# Altium schematic sheet power.SchDoc
size A; SheetNumber: 1; SheetTotal: 14
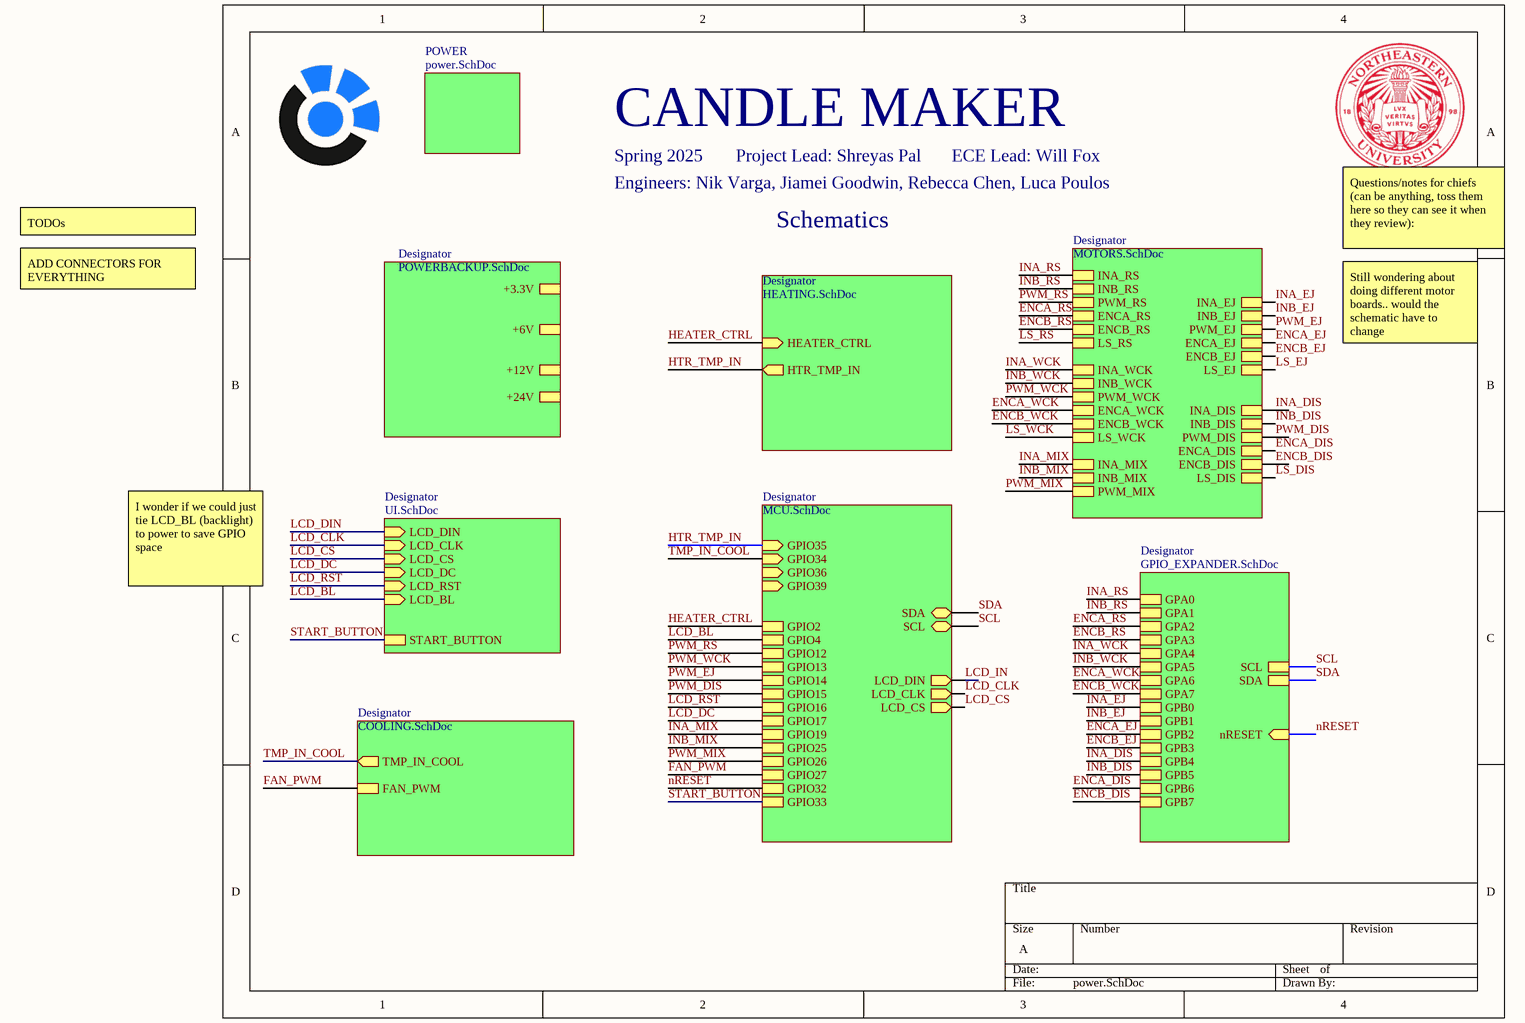
[diagram p0: power.SchDoc]

## Sub-sheets
Designator = HEATING.SchDoc: HEATER_CTRL (in), HTR_TMP_IN (out)
Designator = MCU.SchDoc: GPIO35 (in), SDA (bidir), SCL (bidir), LCD_DIN (out), LCD_CLK (out), LCD_CS (out), GPIO2, GPIO4, GPIO12, GPIO13, GPIO14, GPIO15, GPIO16, GPIO17, GPIO19, GPIO25, GPIO26, GPIO27, GPIO32, GPIO33, GPIO34 (in), GPIO36 (in), GPIO39 (in)
Designator = MOTORS.SchDoc: INA_RS, INB_RS, PWM_RS, ENCA_RS, ENCB_RS, LS_RS, INA_WCK, INB_WCK, PWM_WCK, ENCA_WCK, ENCB_WCK, LS_WCK, INA_MIX, INB_MIX, PWM_MIX, INA_EJ, INB_EJ, PWM_EJ, ENCA_EJ, ENCB_EJ, LS_EJ, INA_DIS, INB_DIS, PWM_DIS, ENCA_DIS, ENCB_DIS, LS_DIS
Designator = COOLING.SchDoc: TMP_IN_COOL (out), FAN_PWM
Designator = POWERBACKUP.SchDoc: +6V, +12V, +24V, +3.3V
Designator = UI.SchDoc: LCD_DIN (in), LCD_CLK (in), LCD_CS (in), LCD_DC (in), LCD_RST (in), LCD_BL (in), START_BUTTON
Designator = GPIO_EXPANDER.SchDoc: GPA0, GPA1, GPA2, GPA3, GPA4, GPA5, GPA6, GPA7, GPB0, GPB1, GPB2, GPB3, GPB4, GPB5, GPB6, GPB7, SCL, SDA, nRESET (in)
POWER = power.SchDoc: no entries

## Nets
ENCA_DIS: sheet Designator/ENCA_DIS, sheet Designator/GPB6
ENCA_EJ: sheet Designator/ENCA_EJ, sheet Designator/GPB2
ENCA_RS: sheet Designator/ENCA_RS, sheet Designator/GPA2
ENCA_WCK: sheet Designator/ENCA_WCK, sheet Designator/GPA6
ENCB_DIS: sheet Designator/ENCB_DIS, sheet Designator/GPB7
ENCB_EJ: sheet Designator/ENCB_EJ, sheet Designator/GPB3
ENCB_RS: sheet Designator/ENCB_RS, sheet Designator/GPA3
ENCB_WCK: sheet Designator/ENCB_WCK, sheet Designator/GPA7
FAN_PWM: sheet Designator/GPIO27, sheet Designator/FAN_PWM
HEATER_CTRL: sheet Designator/HEATER_CTRL, sheet Designator/GPIO2
HTR_TMP_IN: sheet Designator/HTR_TMP_IN, sheet Designator/GPIO35
INA_DIS: sheet Designator/INA_DIS, sheet Designator/GPB4
INA_EJ: sheet Designator/INA_EJ, sheet Designator/GPB0
INA_MIX: sheet Designator/GPIO19, sheet Designator/INA_MIX
INA_RS: sheet Designator/INA_RS, sheet Designator/GPA0
INA_WCK: sheet Designator/INA_WCK, sheet Designator/GPA4
INB_DIS: sheet Designator/INB_DIS, sheet Designator/GPB5
INB_EJ: sheet Designator/INB_EJ, sheet Designator/GPB1
INB_MIX: sheet Designator/GPIO25, sheet Designator/INB_MIX
INB_RS: sheet Designator/INB_RS, sheet Designator/GPA1
INB_WCK: sheet Designator/INB_WCK, sheet Designator/GPA5
LCD_BL: sheet Designator/GPIO4, sheet Designator/LCD_BL
LCD_CLK: sheet Designator/LCD_CLK, sheet Designator/LCD_CLK
LCD_CS: sheet Designator/LCD_CS, sheet Designator/LCD_CS
LCD_DC: sheet Designator/GPIO17, sheet Designator/LCD_DC
LCD_DIN: sheet Designator/LCD_DIN
LCD_IN: sheet Designator/LCD_DIN
LCD_RST: sheet Designator/GPIO16, sheet Designator/LCD_RST
LS_DIS: sheet Designator/LS_DIS
LS_EJ: sheet Designator/LS_EJ
LS_RS: sheet Designator/LS_RS
LS_WCK: sheet Designator/LS_WCK
nRESET: sheet Designator/GPIO32, sheet Designator/nRESET
PWM_DIS: sheet Designator/GPIO15, sheet Designator/PWM_DIS
PWM_EJ: sheet Designator/GPIO14, sheet Designator/PWM_EJ
PWM_MIX: sheet Designator/GPIO26, sheet Designator/PWM_MIX
PWM_RS: sheet Designator/GPIO12, sheet Designator/PWM_RS
PWM_WCK: sheet Designator/GPIO13, sheet Designator/PWM_WCK
SCL: sheet Designator/SCL, sheet Designator/SCL
SDA: sheet Designator/SDA, sheet Designator/SDA
START_BUTTON: sheet Designator/GPIO33, sheet Designator/START_BUTTON
TMP_IN_COOL: sheet Designator/GPIO34, sheet Designator/TMP_IN_COOL

## Notes on the sheet
- CANDLE MAKER
- Spring 2025
- Project Lead: Shreyas Pal
- ECE Lead: Will Fox
- TODOs
- Engineers: Nik Varga, Jiamei Goodwin, Rebecca Chen, Luca Poulos
- Schematics
- ADD CONNECTORS FOR EVERYTHING
- Questions/notes for chiefs (can be anything, toss them here so they can see it when they review):
- Still wondering about doing different motor boards.. would the schematic have to change
- I wonder if we could just tie LCD_BL (backlight) to power to save GPIO space